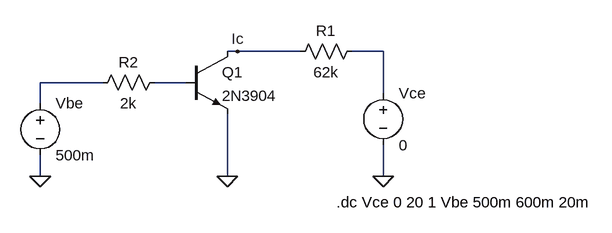
[diagram p0: schematic BJT.asc]
BJT.asc, the LTspice schematic file:
Version 4
SHEET 1 880 680
WIRE 240 80 224 80
WIRE 336 80 240 80
WIRE 464 80 416 80
WIRE 32 128 -64 128
WIRE 160 128 112 128
WIRE 464 144 464 80
WIRE -64 160 -64 128
WIRE -64 272 -64 240
WIRE 224 272 224 176
WIRE 464 272 464 224
FLAG -64 272 0
FLAG 224 272 0
FLAG 464 272 0
FLAG 240 80 Ic
SYMBOL npn 160 80 R0
SYMATTR InstName Q1
SYMATTR Value 2N3904
SYMBOL voltage 464 128 R0
WINDOW 123 0 0 Left 0
WINDOW 39 0 0 Left 0
SYMATTR InstName Vce
SYMATTR Value 0
SYMBOL voltage -64 144 R0
WINDOW 123 0 0 Left 0
WINDOW 39 0 0 Left 0
SYMATTR InstName Vbe
SYMATTR Value 500m
SYMBOL res 432 64 R90
WINDOW 0 0 56 VBottom 2
WINDOW 3 32 56 VTop 2
SYMATTR InstName R1
SYMATTR Value 62k
SYMBOL res 128 112 R90
WINDOW 0 0 56 VBottom 2
WINDOW 3 32 56 VTop 2
SYMATTR InstName R2
SYMATTR Value 2k
TEXT 392 312 Left 2 !.dc Vce 0 20 1 Vbe 500m 600m 20m

The netlist it stands for:
* BJT.asc
Q1 Ic N003 0 0 2N3904
Vce N001 0 0
Vbe N002 0 500m
R1 N001 Ic 62k
R2 N003 N002 2k
.model NPN NPN
.model PNP PNP
.lib standard.bjt
.dc Vce 0 20 1 Vbe 500m 600m 20m
.backanno
.end